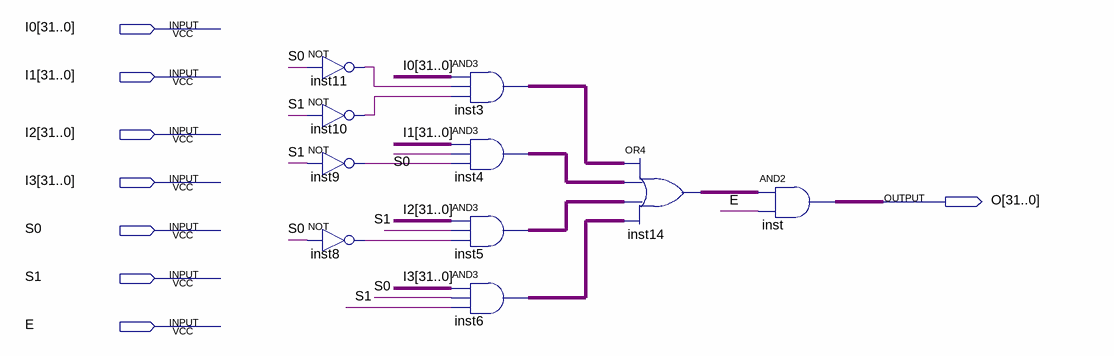
[diagram p0: schematic sheet]
// Quartus schematic MUX4_32.bdf as structural Verilog: 10 symbols, 8 pins
module MUX4_32 (
  input  [31:0] I0,
  input  [31:0] I1,
  input  [31:0] I2,
  input  [31:0] I3,
  input  S0,
  input  S1,
  input  E,
  output [31:0] O
);

  wire inst8_out, inst9_out, inst10_out, inst11_out;
  wire [31:0] inst3_out, inst4_out, inst5_out, inst6_out, inst14_out;

  not inst11 (inst11_out, S0);
  not inst10 (inst10_out, S1);
  not inst9 (inst9_out, S1);
  not inst8 (inst8_out, S0);
  assign inst3_out = I0 & {32{inst11_out}} & {32{inst10_out}};  // AND3 inst3, 32 bits wide
  assign inst4_out = I1 & {32{S0}} & {32{inst9_out}};  // AND3 inst4, 32 bits wide
  assign inst5_out = I2 & {32{S1}} & {32{inst8_out}};  // AND3 inst5, 32 bits wide
  assign inst6_out = I3 & {32{S0}} & {32{S1}};  // AND3 inst6, 32 bits wide
  assign inst14_out = inst3_out | inst4_out | inst5_out | inst6_out;  // OR4 inst14, 32 bits wide
  assign O = inst14_out & {32{E}};  // AND2 inst, 32 bits wide
endmodule
